# Altium schematic sheet LXF1768.SchDoc
size A3
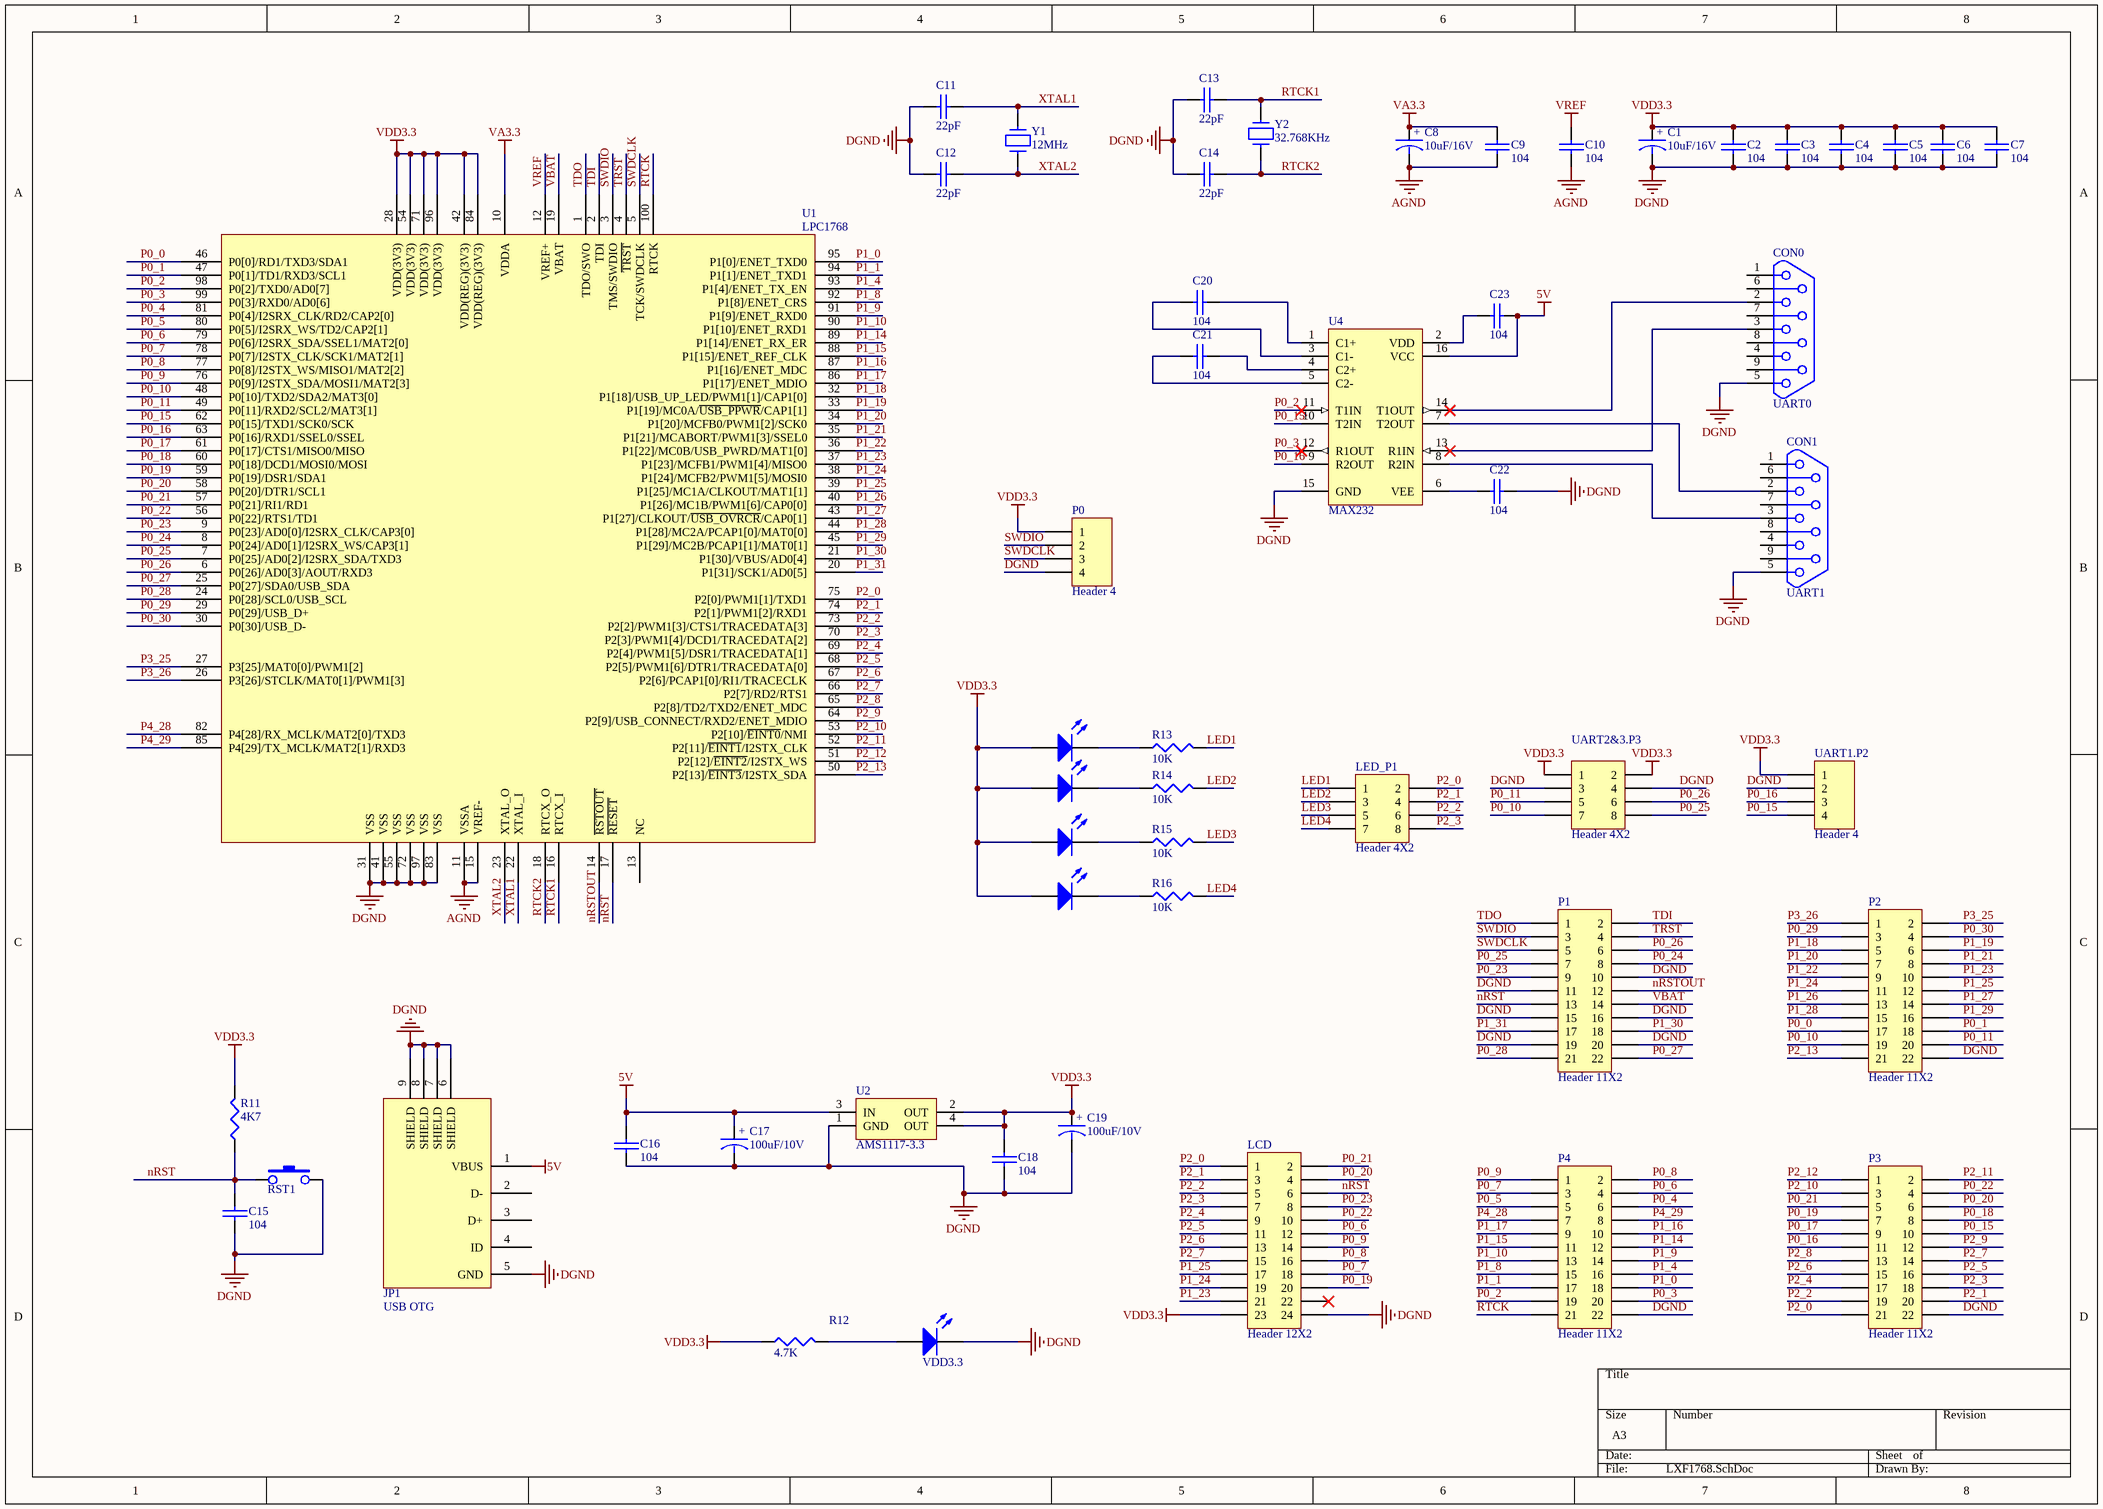
[diagram p0: LXF1768.SchDoc]

## Parts
C1  10uF/16V  [CAP-A]
C2  104  [0603]
C3  104  [0603]
C4  104  [0603]
C5  104  [0603]
C6  104  [0603]
C7  104  [0603]
C8  10uF/16V  [CAP-A]
C9  104  [0603]
C10  104  [0603]
C11  22pF  [0603]
C12  22pF  [0603]
C13  22pF  [0603]
C14  22pF  [0603]
C15  104  [0603]
C16  104  [0603]
C17  100uF/10V  [CAP-B]
C18  104  [0603]
C19  100uF/10V  [CAP-B]
C20  104  [0603]
C21  104  [0603]
C22  104  [0603]
C23  104  [0603]
CON0  UART0  [DB-9RA/F]
CON1  UART1  [DB-9RA/F]
JP1  USB OTG  [USB_MINIB_SMT]
LCD  Header 12X2  [HDR2X12]
LED1  PC2  [LED_0603_BLUE]  (value not drawn)
LED2  PC2  [LED_0603_BLUE]  (value not drawn)
LED3  PC2  [LED_0603_BLUE]  (value not drawn)
LED4  PC2  [LED_0603_BLUE]  (value not drawn)
LED_P1  Header 4X2  [HDR2X4]
P0  Header 4  [HDR1X4]
P1  Header 11X2  [HDR2X11]
P2  Header 11X2  [HDR2X11]
P3  Header 11X2  [HDR2X11]
P4  Header 11X2  [HDR2X11]
R11  4K7  [0603]
R12  4.7K  [0603]
R13  10K  [0603]
R14  10K  [0603]
R15  10K  [0603]
R16  10K  [0603]
RST1  KEY  [KEY-6A]  (value not drawn)
U1  LPC1768  [TQFP-100]
U2  AMS1117-3.3  [ZZ311]
U4  MAX232  [NSO16]
UART1.P2  Header 4  [HDR1X4]
UART2&3.P3  Header 4X2  [HDR2X4]
VDD3.3  PC2  [LED_0603_BLUE]  (value not drawn)
Y1  12MHz  [XTAL-D]
Y2  32.768KHz  [CRY-32]

## Nets
5V: C16.1 C17.1 C23.2 JP1.1(VBUS) U2.3(IN) U4.16(VCC)
AGND: C8.2 C9.2 C10.2 U1.11(VSSA) U1.15(VREF-)
DGND: C1.2 C2.2 C3.2 C4.2 C5.2 C6.2 C7.2 C11.1 C12.1 C13.1 C14.1 C15.2 C16.2 C17.2 C18.2 C19.2 C22.2 CON0.5 CON1.5 JP1.5(GND) JP1.6(SHIELD) JP1.7(SHIELD) JP1.8(SHIELD) JP1.9(SHIELD) LCD.24 P0.4 P1.10 P1.11 P1.15 P1.16 P1.19 P1.20 P2.22 P3.22 P4.22 RST1.2 U1.31(VSS) U1.41(VSS) U1.55(VSS) U1.72(VSS) U1.83(VSS) U1.97(VSS) U2.1(GND) U4.15(GND) UART1.P2.2 UART2&3.P3.3 UART2&3.P3.4 VDD3.3.2(K)
VA3.3: C8.1 C9.1 U1.10(VDDA)
VDD3.3: C1.1 C2.1 C3.1 C4.1 C5.1 C6.1 C7.1 C18.1 C19.1 LCD.23 LED1.1(A) LED2.1(A) LED3.1(A) LED4.1(A) P0.1 R11.2 R12.1 U1.28(VDD(3V3)) U1.42(VDD(REG)(3V3)) U1.54(VDD(3V3)) U1.71(VDD(3V3)) U1.84(VDD(REG)(3V3)) U1.96(VDD(3V3)) U2.2(OUT) U2.4(OUT) UART1.P2.1 UART2&3.P3.1 UART2&3.P3.2
VREF: C10.1 U1.12(VREF+)
LED1: LED_P1.1 R13.2
LED2: LED_P1.3 R14.2
LED3: LED_P1.5 R15.2
LED4: LED_P1.7 R16.2
nRST: C15.1 LCD.6 P1.13 R11.1 RST1.1 U1.17(~{RESET})
nRSTOUT: P1.12 U1.14(~{RSTOUT})
P0_0: P2.17 U1.46(P0[0]/RD1/TXD3/SDA1)
P0_1: P2.18 U1.47(P0[1]/TD1/RXD3/SCL1)
P0_2: P4.19 U1.98(P0[2]/TXD0/AD0[7]) U4.11(T1IN)
P0_3: P4.20 U1.99(P0[3]/RXD0/AD0[6]) U4.12(R1OUT)
P0_4: P4.6 U1.81(P0[4]/I2SRX_CLK/RD2/CAP2[0])
P0_5: P4.5 U1.80(P0[5]/I2SRX_WS/TD2/CAP2[1])
P0_6: LCD.12 P4.4 U1.79(P0[6]/I2SRX_SDA/SSEL1/MAT2[0])
P0_7: LCD.18 P4.3 U1.78(P0[7]/I2STX_CLK/SCK1/MAT2[1])
P0_8: LCD.16 P4.2 U1.77(P0[8]/I2STX_WS/MISO1/MAT2[2])
P0_9: LCD.14 P4.1 U1.76(P0[9]/I2STX_SDA/MOSI1/MAT2[3])
P0_10: P2.19 U1.48(P0[10]/TXD2/SDA2/MAT3[0]) UART2&3.P3.7
P0_11: P2.20 U1.49(P0[11]/RXD2/SCL2/MAT3[1]) UART2&3.P3.5
P0_15: P3.10 U1.62(P0[15]/TXD1/SCK0/SCK) U4.10(T2IN) UART1.P2.4
P0_16: P3.11 U1.63(P0[16]/RXD1/SSEL0/SSEL) U4.9(R2OUT) UART1.P2.3
P0_17: P3.9 U1.61(P0[17]/CTS1/MISO0/MISO)
P0_18: P3.8 U1.60(P0[18]/DCD1/MOSI0/MOSI)
P0_19: LCD.20 P3.7 U1.59(P0[19]/DSR1/SDA1)
P0_20: LCD.4 P3.6 U1.58(P0[20]/DTR1/SCL1)
P0_21: LCD.2 P3.5 U1.57(P0[21]/RI1/RD1)
P0_22: LCD.10 P3.4 U1.56(P0[22]/RTS1/TD1)
P0_23: LCD.8 P1.9 U1.9(P0[23]/AD0[0]/I2SRX_CLK/CAP3[0])
P0_24: P1.8 U1.8(P0[24]/AD0[1]/I2SRX_WS/CAP3[1])
P0_25: P1.7 U1.7(P0[25]/AD0[2]/I2SRX_SDA/TXD3) UART2&3.P3.8
P0_26: P1.6 U1.6(P0[26]/AD0[3]/AOUT/RXD3) UART2&3.P3.6
P0_27: P1.22 U1.25(P0[27]/SDA0/USB_SDA)
P0_28: P1.21 U1.24(P0[28]/SCL0/USB_SCL)
P0_29: P2.3 U1.29(P0[29]/USB_D+)
P0_30: P2.4 U1.30(P0[30]/USB_D-)
P1_0: P4.18 U1.95(P1[0]/ENET_TXD0)
P1_1: P4.17 U1.94(P1[1]/ENET_TXD1)
P1_4: P4.16 U1.93(P1[4]/ENET_TX_EN)
P1_8: P4.15 U1.92(P1[8]/ENET_CRS)
P1_9: P4.14 U1.91(P1[9]/ENET_RXD0)
P1_10: P4.13 U1.90(P1[10]/ENET_RXD1)
P1_14: P4.12 U1.89(P1[14]/ENET_RX_ER)
P1_15: P4.11 U1.88(P1[15]/ENET_REF_CLK)
P1_16: P4.10 U1.87(P1[16]/ENET_MDC)
P1_17: P4.9 U1.86(P1[17]/ENET_MDIO)
P1_18: P2.5 U1.32(P1[18]/USB_UP_LED/PWM1[1]/CAP1[0])
P1_19: P2.6 U1.33(P1[19]/MC0A/~{USB_PPWR}/CAP1[1])
P1_20: P2.7 U1.34(P1[20]/MCFB0/PWM1[2]/SCK0)
P1_21: P2.8 U1.35(P1[21]/MCABORT/PWM1[3]/SSEL0)
P1_22: P2.9 U1.36(P1[22]/MC0B/USB_PWRD/MAT1[0])
P1_23: LCD.21 P2.10 U1.37(P1[23]/MCFB1/PWM1[4]/MISO0)
P1_24: LCD.19 P2.11 U1.38(P1[24]/MCFB2/PWM1[5]/MOSI0)
P1_25: LCD.17 P2.12 U1.39(P1[25]/MC1A/CLKOUT/MAT1[1])
P1_26: P2.13 U1.40(P1[26]/MC1B/PWM1[6]/CAP0[0])
P1_27: P2.14 U1.43(P1[27]/CLKOUT/~{USB_OVRCR}/CAP0[1])
P1_28: P2.15 U1.44(P1[28]/MC2A/PCAP1[0]/MAT0[0])
P1_29: P2.16 U1.45(P1[29]/MC2B/PCAP1[1]/MAT0[1])
P1_30: P1.18 U1.21(P1[30]/VBUS/AD0[4])
P1_31: P1.17 U1.20(P1[31]/SCK1/AD0[5])
P2_0: LCD.1 LED_P1.2 P3.21 U1.75(P2[0]/PWM1[1]/TXD1)
P2_1: LCD.3 LED_P1.4 P3.20 U1.74(P2[1]/PWM1[2]/RXD1)
P2_2: LCD.5 LED_P1.6 P3.19 U1.73(P2[2]/PWM1[3]/CTS1/TRACEDATA[3])
P2_3: LCD.7 LED_P1.8 P3.18 U1.70(P2[3]/PWM1[4]/DCD1/TRACEDATA[2])
P2_4: LCD.9 P3.17 U1.69(P2[4]/PWM1[5]/DSR1/TRACEDATA[1])
P2_5: LCD.11 P3.16 U1.68(P2[5]/PWM1[6]/DTR1/TRACEDATA[0])
P2_6: LCD.13 P3.15 U1.67(P2[6]/PCAP1[0]/RI1/TRACECLK)
P2_7: LCD.15 P3.14 U1.66(P2[7]/RD2/RTS1)
P2_8: P3.13 U1.65(P2[8]/TD2/TXD2/ENET_MDC)
P2_9: P3.12 U1.64(P2[9]/USB_CONNECT/RXD2/ENET_MDIO)
P2_10: P3.3 U1.53(P2[10]/~{EINT0}/NMI)
P2_11: P3.2 U1.52(P2[11]/~{EINT1}/I2STX_CLK)
P2_12: P3.1 U1.51(P2[12]/~{EINT2}/I2STX_WS)
P2_13: P2.21 U1.50(P2[13]/~{EINT3}/I2STX_SDA)
P3_25: P2.2 U1.27(P3[25]/MAT0[0]/PWM1[2])
P3_26: P2.1 U1.26(P3[26]/STCLK/MAT0[1]/PWM1[3])
P4_28: P4.7 U1.82(P4[28]/RX_MCLK/MAT2[0]/TXD3)
P4_29: P4.8 U1.85(P4[29]/TX_MCLK/MAT2[1]/RXD3)
RTCK: P4.21 U1.100(RTCK)
RTCK1: C13.2 U1.16(RTCX_I) Y2.2
RTCK2: C14.2 U1.18(RTCX_O) Y2.1
SWDCLK: P0.3 P1.5 U1.5(TCK/SWDCLK)
SWDIO: P0.2 P1.3 U1.3(TMS/SWDIO)
TDI: P1.2 U1.2(TDI)
TDO: P1.1 U1.1(TDO/SWO)
TRST: P1.4 U1.4(~{TRST})
VBAT: P1.14 U1.19(VBAT)
XTAL1: C11.2 U1.22(XTAL_I) Y1.2
XTAL2: C12.2 U1.23(XTAL_O) Y1.1
NetC20_1: C20.1 U4.3(C1-)
NetC20_2: C20.2 U4.1(C1+)
NetC21_1: C21.1 U4.5(C2-)
NetC21_2: C21.2 U4.4(C2+)
NetC22_1: C22.1 U4.6(VEE)
NetC23_1: C23.1 U4.2(VDD)
NetCON0_2: CON0.2 U4.14(T1OUT)
NetCON0_3: CON0.3 U4.13(R1IN)
NetCON1_2: CON1.2 U4.7(T2OUT)
NetCON1_3: CON1.3 U4.8(R2IN)
NetLED1_2: LED1.2(K) R13.1
NetLED2_2: LED2.2(K) R14.1
NetLED3_2: LED3.2(K) R15.1
NetLED4_2: LED4.2(K) R16.1
NetR12_2: R12.2 VDD3.3.1(A)

Not connected (* = marked no-connect by the designer): CON0 1 4 6 7 8 9; CON1 1 4 6 7 8 9; JP1 2(D-) 3(D+) 4(ID); LCD 22*; U1 13(NC)

## Notes on the sheet
- (in symbol CAPACITOR POL) +
- (in symbol CAPACITOR POL_2) +

## Library data of the parts
C1 C8 = CAPACITOR POL: Capacitor
C2-C7 C9-C16 C18 C20-C23 = CAP: Capacitor
C17 C19 = CAPACITOR POL_2: Capacitor
CON0 CON1 = DB9
JP1 = USB MINI-AB
LCD = Header 12X2: Header, 12-Pin, Dual row; LatestRevisionDate: 17-Jul-2002; LatestRevisionNote: Re-released for DXP Platform.; Publisher: Altium Limited
LED1-LED4 VDD3.3 = LED0: Typical INFRARED GaAs LED
LED_P1 UART2&3.P3 = Header 4X2: Header, 4-Pin, Dual row; LatestRevisionDate: 17-Jul-2002; LatestRevisionNote: Re-released for DXP Platform.; Publisher: Altium Limited
P0 UART1.P2 = Header 4: Header, 4-Pin; LatestRevisionDate: 17-Jul-2002; LatestRevisionNote: Re-released for DXP Platform.; Publisher: Altium Limited
P1-P4 = Header 11X2: Header, 11-Pin, Dual row; LatestRevisionDate: 17-Jul-2002; LatestRevisionNote: Re-released for DXP Platform.; Publisher: Altium Limited
R11-R16 = RES1_2
RST1 = SW-PB
U2 = REG1117-5: 800mA and 1A Low Dropout Positive Regulator 2.85V, 3.3V, 5V, and Adjustable; Published: 8-Jun-2000; LatestRevisionDate: 17-Jul-2002; LatestRevisionNote: Re-released for DXP Platform.; DatasheetVersion: Sep-1997; PackageVersion: revC; PackageReference: ZZ311; Publisher: Altium Limited; PackageDescription: SOT-223/SC-73; 4 Leads; Body 6.7 x 7.3 mm, inc. leads (LxW max); ComponentLink1Description: Manufacturer Link; ComponentLink1URL: http://www.ti.com/; ComponentLink2Description: Datasheet; ComponentLink2URL: http://www-s.ti.com/sc/ds/REG1117.pdf
U4 = MAX232ACSE: +5V Powered, Multi-Channel RS-232 Driver/Receiver; Code - JEDEC: MS-012-AC; Code - IPC: SO16; Published: 16-Jan-2001; Revision: 17-Jul-2002: Re-released for DXP Platform.; Package Reference: NSO16; Publisher: Altium Limited
Y1 = CRYSTAL
Y2 = CRYSTAL_1: Crystal